# EAGLE schematic Schematic_v2 (EAGLE 9.7.0)
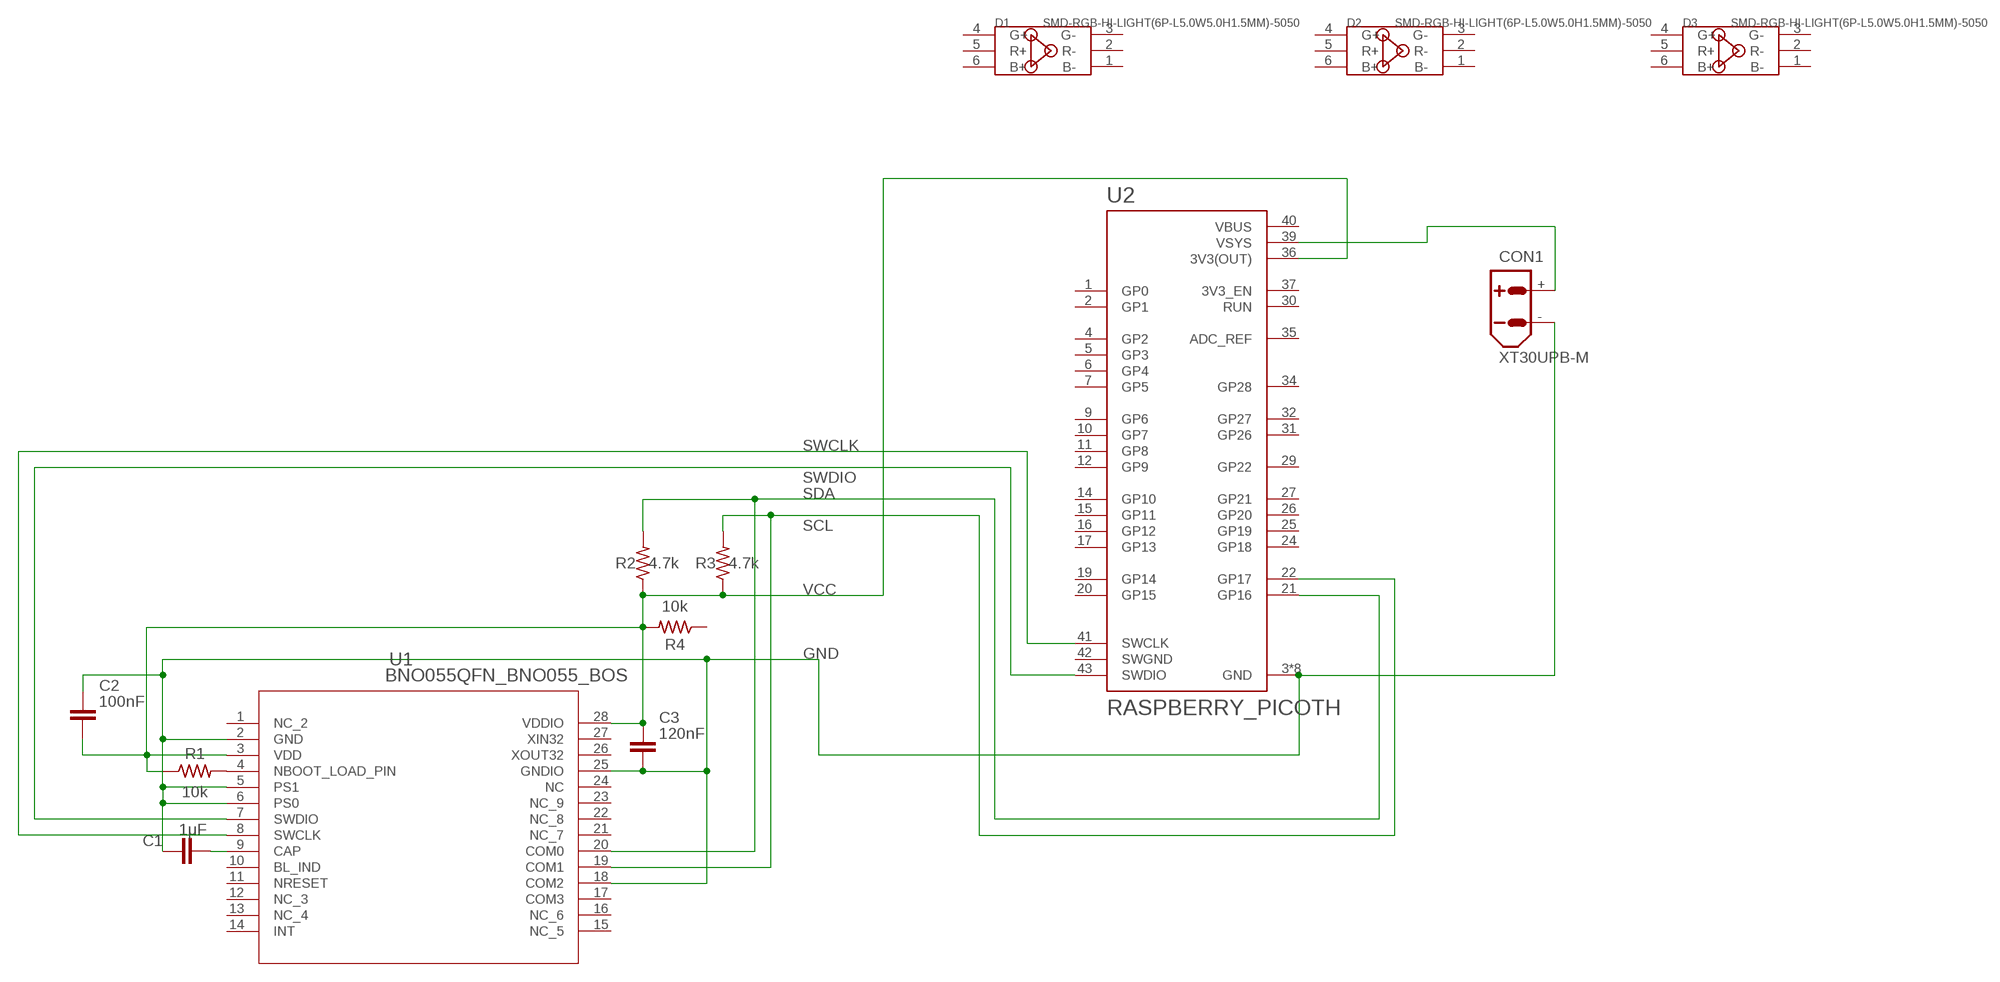
[diagram p0: schematic, sheet 1]

## Parts
C1  1μF  C_CHIP-1206(3216-METRIC)  [CAPC3216X135]
C2  100nF  C_CHIP-1206(3216-METRIC)  [CAPC3216X135]
C3  120nF  C_CHIP-1206(3216-METRIC)  [CAPC3216X135]
CON1  XT30UPB-M  [XT30UPB-M]
D1  SMD-RGB-HI-LIGHT(6P-L5.0W5.0H1.5MM)-5050  [LED6-SMD-5050]
D2  SMD-RGB-HI-LIGHT(6P-L5.0W5.0H1.5MM)-5050  [LED6-SMD-5050]
D3  SMD-RGB-HI-LIGHT(6P-L5.0W5.0H1.5MM)-5050  [LED6-SMD-5050]
R1  10k  R-US_CHIP-1206(3216-METRIC)  [RESC3216X70]
R2  4.7k  R-US_CHIP-1206(3216-METRIC)  [RESC3216X70]
R3  4.7k  R-US_CHIP-1206(3216-METRIC)  [RESC3216X70]
R4  10k  R-US_CHIP-1206(3216-METRIC)  [RESC3216X70]
U1  BNO055QFN_BNO055_BOS  [QFN_BNO055_BOS]
U2  RASPBERRY_PICOTH  [PICO-PKG-TH]

## Nets
GND: C1.1 C2.1 C3.2 CON1.- U1.2(GND) U1.5(PS1) U1.6(PS0) U1.18(COM2) U1.25(GNDIO) U2.3(GND) U2.8(GND) U2.13(GND) U2.18(GND) U2.23(GND) U2.28(GND) U2.33(GND) U2.38(GND)
N$1: C1.2 U1.9(CAP)
N$2: R1.2 U1.4(NBOOT_LOAD_PIN)
N$3: CON1.+ U2.39(VSYS)
SCL: R3.2 U1.19(COM1) U2.22(GP17)
SDA: R2.2 U1.20(COM0) U2.21(GP16)
SWCLK: U1.8(SWCLK) U2.41(SWCLK)
SWDIO: U1.7(SWDIO) U2.43(SWDIO)
VCC: C2.2 C3.1 R1.1 R2.1 R3.1 R4.2 U1.3(VDD) U1.28(VDDIO) U2.36(3V3(OUT))
Unconnected: D1.1(B-) D1.2(R-) D1.3(G-) D1.4(G+) D1.5(R+) D1.6(B+) D2.1(B-) D2.2(R-) D2.3(G-) D2.4(G+) D2.5(R+) D2.6(B+) D3.1(B-) D3.2(R-) D3.3(G-) D3.4(G+) D3.5(R+) D3.6(B+) R4.1 U1.1(NC_2) U1.10(BL_IND) U1.11(NRESET) U1.12(NC_3) U1.13(NC_4) U1.14(INT) U1.15(NC_5) U1.16(NC_6) U1.17(COM3) U1.21(NC_7) U1.22(NC_8) U1.23(NC_9) U1.24(NC) U1.26(XOUT32) U1.27(XIN32) U2.1(GP0) U2.2(GP1) U2.4(GP2) U2.5(GP3) U2.6(GP4) U2.7(GP5) U2.9(GP6) U2.10(GP7) U2.11(GP8) U2.12(GP9) U2.14(GP10) U2.15(GP11) U2.16(GP12) U2.17(GP13) U2.19(GP14) U2.20(GP15) U2.24(GP18) U2.25(GP19) U2.26(GP20) U2.27(GP21) U2.29(GP22) U2.30(RUN) U2.31(GP26) U2.32(GP27) U2.34(GP28) U2.35(ADC_REF) U2.37(3V3_EN)

## Power pins joined to a net without a drawn wire
SWGND: U2.42(SWGND)
VBUS: U2.40(VBUS)

## Library data of the parts
C1-C3 = Capacitor:C: Capacitor - Generic; CATEGORY: Capacitor
CON1 = amass:XT30: AMASS XT30 connector Store in Japan AMASS XT30 connector <https://szc.jp/ams-xt30>
D1-D3 = 5050RGB SparkFun:SMD-RGB-HI-LIGHT(6P-L5.0*W5.0*H1.5MM): 304090049 Check availability <https://pricing.snapeda.com/parts/5050RGB/SparkFun%20Electronics/view-part?ref=eda>; AVAILABILITY: Not in stock; CHECK_PRICES: https://www.snapeda.com/parts/5050RGB/SparkFun+Electronics/view-part/?ref=eda; DESCRIPTION: Addressable Lighting - 1 LED Discrete PWM Red, Green, Blue (RGB) 5.00mm L x 5.00mm W; MF: SparkFun Electronics; MP: 5050RGB; PACKAGE: Package; PRICE: None; SNAPEDA_LINK: https://www.snapeda.com/parts/5050RGB/SparkFun+Electronics/view-part/?ref=snap
R1-R4 = Resistor:R-US: Resistor Fixed - ANSI; CATEGORY: Resistor; SUB-CATEGORY: Fixed
U1 = 2024-07-31_17-07-40_Library:BNO055; COPYRIGHT: Copyright (C) 2024 Ultra Librarian. All rights reserved.; MANUFACTURER_PART_NUMBER: BNO055; MFR_NAME: Bosch Sensortec
U2 = RPI Pico Eagle lib:RASPBERRY_PICO: Raspberry Pi Pico